# Altium schematic sheet MISC.SchDoc
size A4; SheetNumber: 5
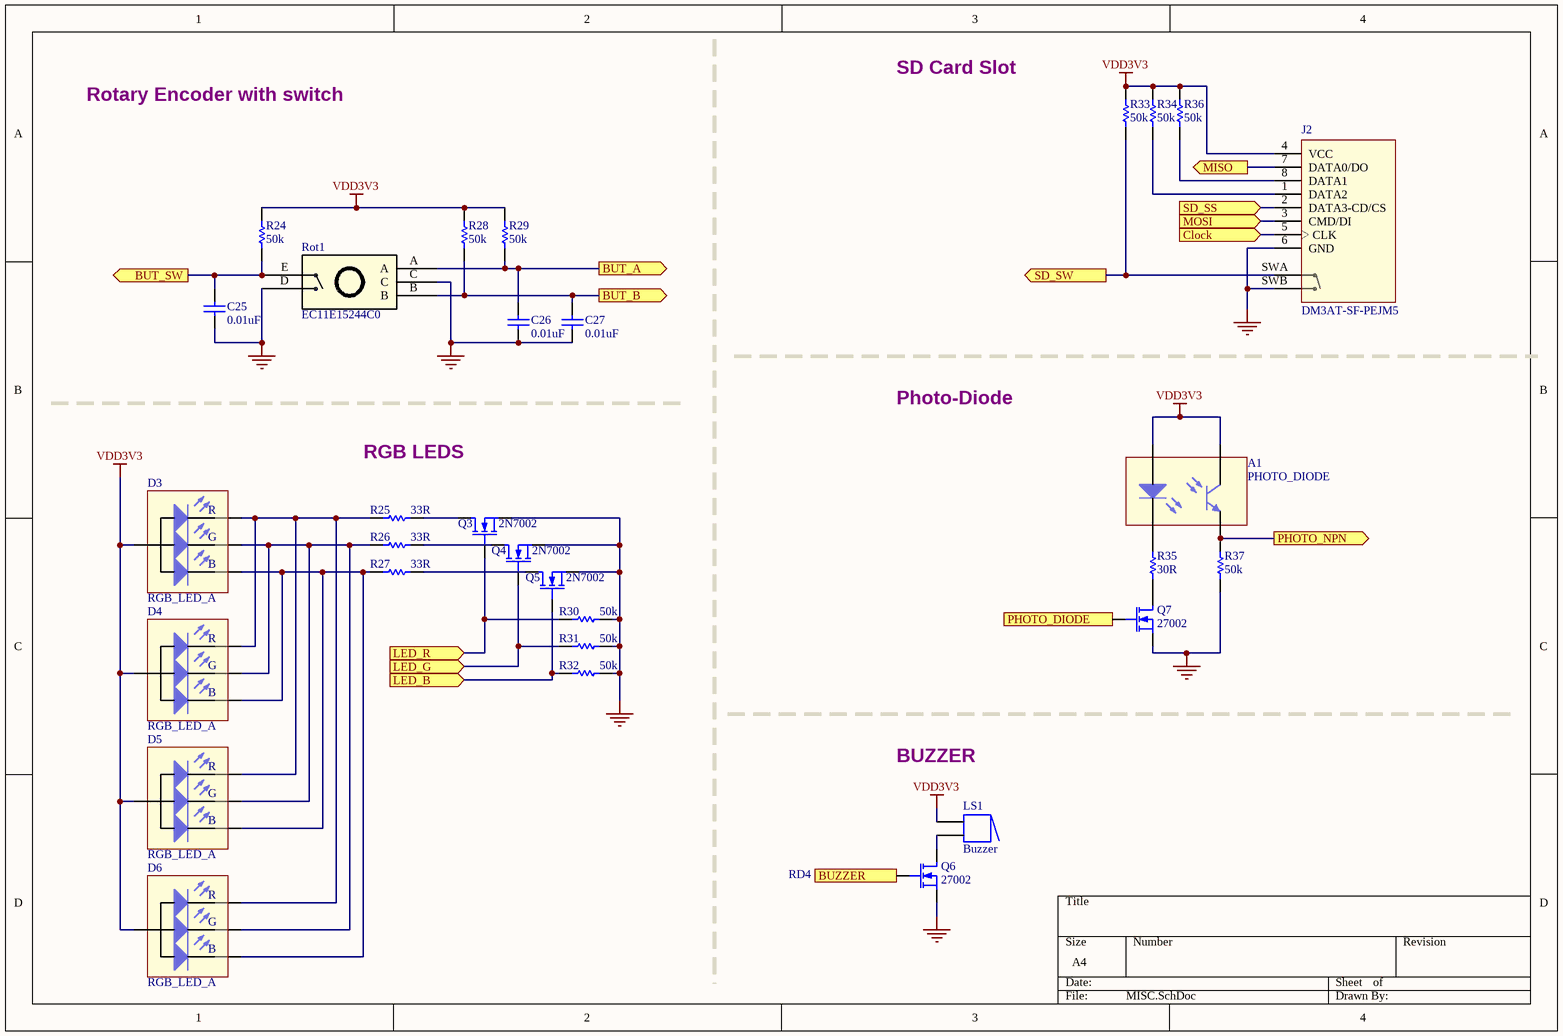
[diagram p0: MISC.SchDoc]

## Parts
A1  PHOTO_DIODE  [TCRT5000]
C25  0.01uF  [CAPC1608X90N]
C26  0.01uF  [CAPC1608X90N]
C27  0.01uF  [CAPC1608X90N]
D3  RGB_LED_A  [RGB_LED]
D4  RGB_LED_A  [RGB_LED]
D5  RGB_LED_A  [RGB_LED]
D6  RGB_LED_A  [RGB_LED]
J2  DM3AT-SF-PEJM5  [HRS_DM3AT-SF-PEJM5_DM3AT-SF-PEJM5(Primary)]
LS1  Buzzer  [ABT-460-RC]
Q3  2N7002  [SOT23-3]
Q4  2N7002  [SOT23-3]
Q5  2N7002  [SOT23-3]
Q6  27002  [SOT23-3]
Q7  27002  [SOT23-3]
R24  50k  [RESC1608X55N]
R25  33R  [RESC1608X55N]
R26  33R  [RESC1608X55N]
R27  33R  [RESC1608X55N]
R28  50k  [RESC1608X55N]
R29  50k  [RESC1608X55N]
R30  50k  [RESC1608X55N]
R31  50k  [RESC1608X55N]
R32  50k  [RESC1608X55N]
R33  50k  [RESC1608X55N]
R34  50k  [RESC1608X55N]
R35  30R  [RESC1608X55N]
R36  50k  [RESC1608X55N]
R37  50k  [RESC1608X55N]
Rot1  EC11E15244C0  [EC11E15244C0]

## Ports
BUT_A (out), BUT_B (out), BUT_SW (out), BUZZER (in), Clock (in), LED_B (in), LED_G (in), LED_R (in), MISO (out), MOSI (in), PHOTO_DIODE (in), PHOTO_NPN (out), SD_SS (in), SD_SW (out)

## Nets
GND: C25.1 C26.1 C27.1 J2.6(GND) J2.SWB(B) Q3.2(S) Q4.2(S) Q5.2(S) Q6.2(S) Q7.2(S) R30.2 R31.2 R32.2 R37.1 Rot1.C Rot1.D(Switch)
VDD3V3: A1.2 A1.3 D3.2(Cathode) D4.2(Cathode) D5.2(Cathode) D6.2(Cathode) J2.4(VCC) LS1.1 R24.2 R28.2 R29.2 R33.2 R34.2 R36.2
BUT_A: C26.2 R29.1 Rot1.A ; port BUT_A
BUT_B: C27.2 R28.1 Rot1.B ; port BUT_B
BUT_SW: C25.2 R24.1 Rot1.E(Switch) ; port BUT_SW
BUZZER: Q6.1(G) ; port BUZZER
Clock: J2.5(CLK) ; port Clock
LED_B: Q5.1(G) R32.1 ; port LED_B
LED_G: Q4.1(G) R31.1 ; port LED_G
LED_R: Q3.1(G) R30.1 ; port LED_R
MISO: J2.7(DATA0/DO) ; port MISO
MOSI: J2.3(CMD/DI) ; port MOSI
PHOTO_DIODE: Q7.1(G) ; port PHOTO_DIODE
PHOTO_NPN: A1.1 R37.2 ; port PHOTO_NPN
SD_SS: J2.2(DATA3-CD/CS) ; port SD_SS
SD_SW: J2.SWA(A) R33.1 ; port SD_SW
NetA1_4: A1.4 R35.2
NetD3_1: D3.1(R) D4.1(R) D5.1(R) D6.1(R) R25.1
NetD3_3: D3.3(G) D4.3(G) D5.3(G) D6.3(G) R26.1
NetD3_4: D3.4(B) D4.4(B) D5.4(B) D6.4(B) R27.1
NetJ2_1: J2.1(DATA2) R34.1
NetJ2_8: J2.8(DATA1) R36.1
NetLS1_2: LS1.2 Q6.3(D)
NetQ3_3: Q3.3(D) R25.2
NetQ4_3: Q4.3(D) R26.2
NetQ5_3: Q5.3(D) R27.2
NetQ7_3: Q7.3(D) R35.1

## Notes on the sheet
- Rotary Encoder with switch
- SD Card Slot
- Photo-Diode
- RGB LEDS
- BUZZER
- RD4

## Library data of the parts
A1 = PHOTO_DIODE: Photo-diode; Fabricant: VISHAY; Fournisseur: Farnell; Fournisseur_REF: 1470066; Fabricant_REF: TCRT5000; Price: 0.7
C25-C27 = Capacitor: Value: 100pF; Published: 8-Jun-2000; LatestRevisionDate: 17-Jul-2002; LatestRevisionNote: Re-released for DXP Platform.; PackageReference: RAD-0.3; Publisher: Altium Limited; PackageDescription: Radial Cap, Thru-Hole; 2 Leads; 0.3 in Pin Spacing
D3-D6 = RGB_LED_A: RGB_LED Common Anode; Fournisseur: Aliexpress; Price: 0.004
J2 = DM3AT-SF-PEJM5: DM3 RA SMT microSD memory card push/push; Fabricant: HIROSE(HRS); Fournisseur: Farnell; Fournisseur_REF: 1764374; Fabricant_REF: DM3AT-SF-PEJM5(40); Price: 2.64
LS1 = Buzzer: Magnetic Transducer Buzzer; Fabricant: PRO SIGNAL; Fournisseur: Farnell; Fournisseur_REF: 2783902; Price: 1.55; Fabricant_REF: ABT-460-RC
Q3-Q7 = MOSFET-N: N-Channel MOSFET; Fabricant: NEXPERIA; Fournisseur: Farnell; Fournisseur_REF: 1859847; Fabricant_REF: 2N7002BK; Price: 0.196
R24-R37 = Resistor: Fabricant: MULTICOMP; Fournisseur: Farnell
Rot1 = EC11E15244C0: Rotary Encoder; Fabricant: ALPS; Fournisseur: Farnell; Fournisseur_REF: 1520806; Price: 3.32; Fabricant_REF: EC11E15244C0